# EAGLE design SMAC-2530 (EAGLE 7.1.0)
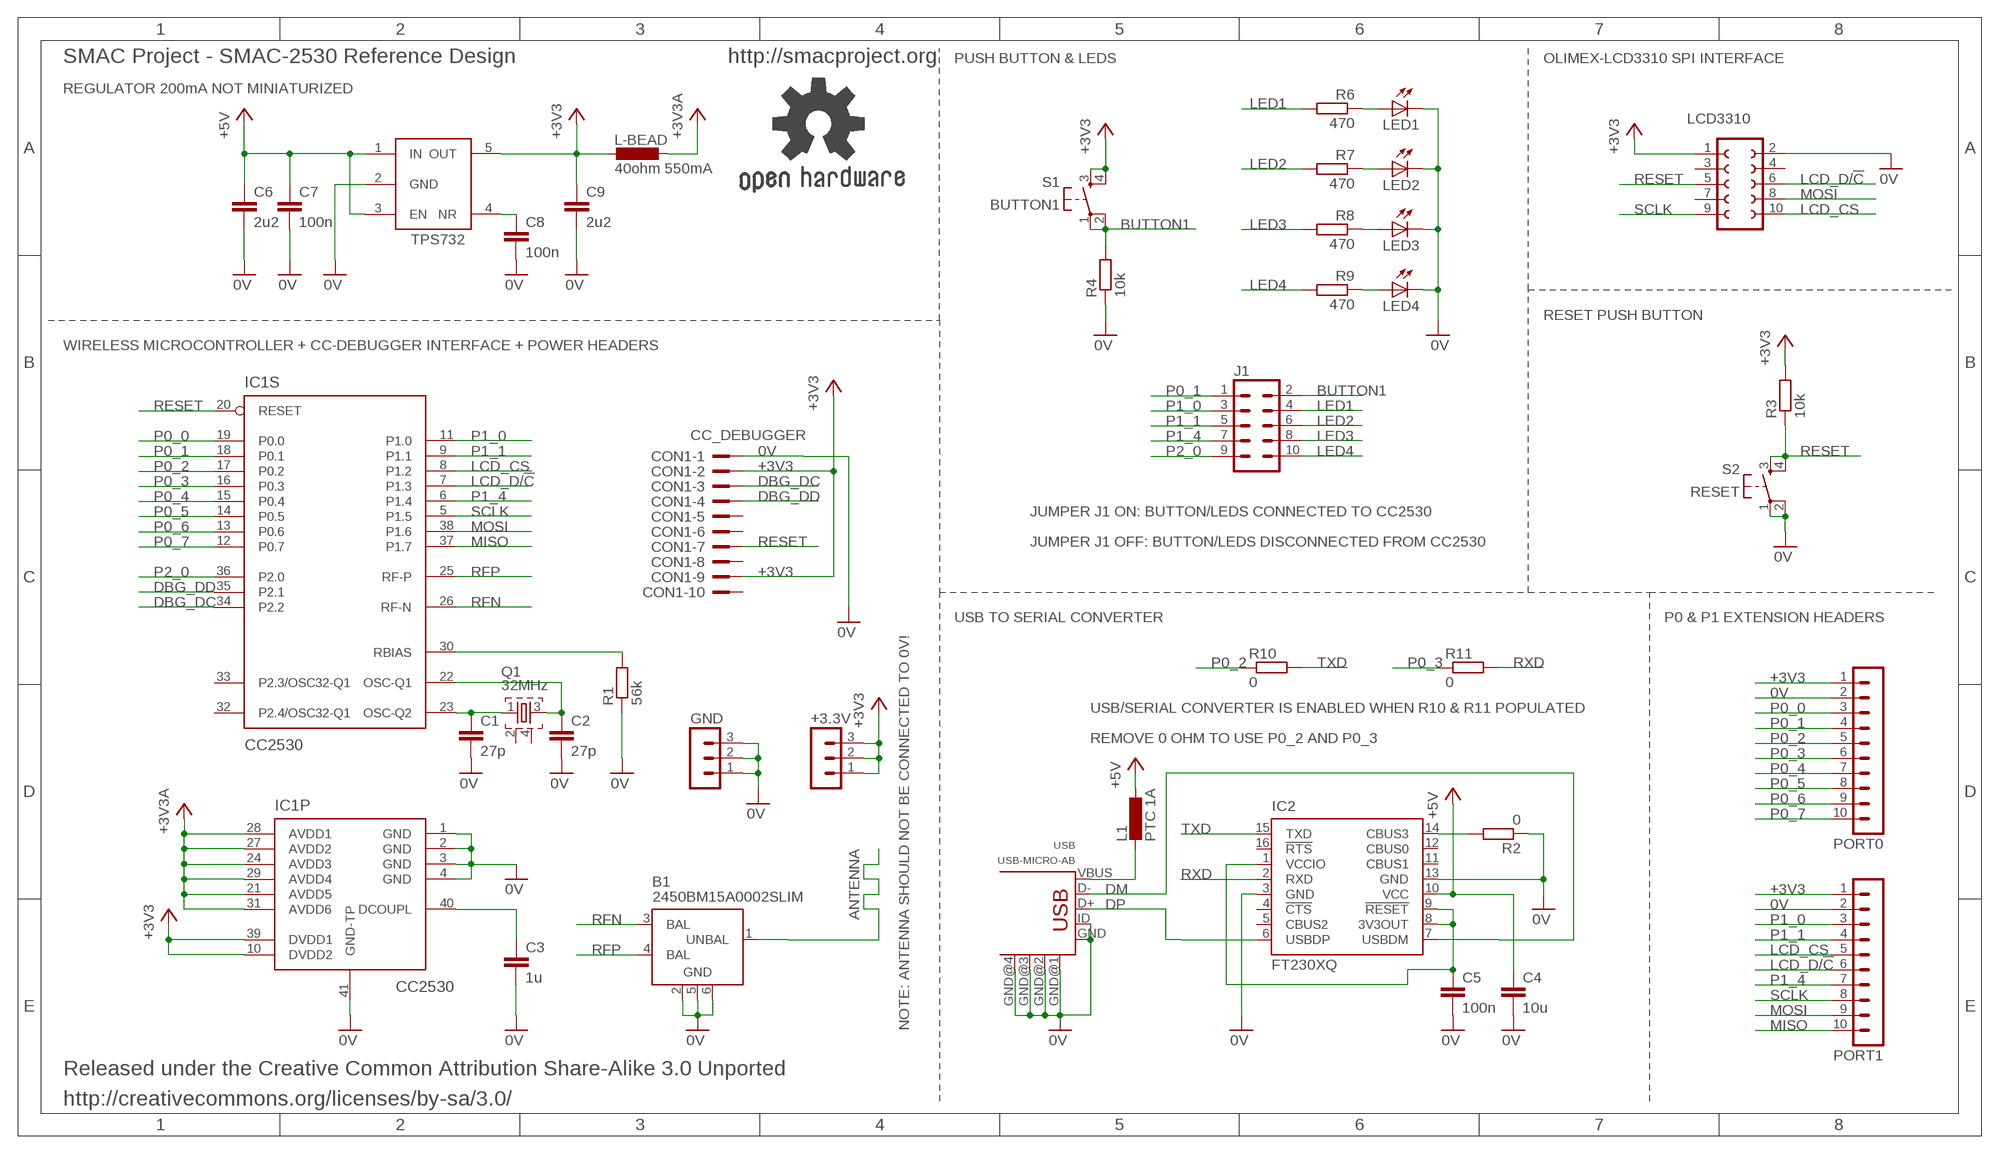
[diagram p0: schematic, sheet 1]

## Parts
+3.3V  MA03-1  [MA03-1]
B1  2450BM15A0002SLIM  [2450BM15A0002-SLIM]
C1  27p  C-EUC0603K  [C0603K]
C2  27p  C-EUC0603K  [C0603K]
C3  1u  C-EUC0603K  [C0603K]
C4  10u  C-EUC0603K  [C0603K]
C5  100n  C-EUC0603K  [C0603K]
C6  2u2  C-EUC0603K  [C0603K]
C7  100n  C-EUC0603K  [C0603K]
C8  100n  C-EUC0603K  [C0603K]
C9  2u2  C-EUC0603K  [C0603K]
CON1  CC_DEBUGGER  2510-  [PAK100/2500-10]
GND  MA03-1  [MA03-1]
GOLD_ORB_SM1  OSHWLOGO_GOLD_ORB_SM  [OSHW2]
IC1  CC2530  [QFN50P600X600X100-41N]
IC2  FT230XQ  [QFN16]
IC3  TPS732XX  [SOT23]
J1  MA05-2  [MA05-2]
L1  PTC 1A  L-EUL0603K  [L0603K]
L-BEAD  40ohm 550mA  L-EUL0603K  [L0603K]
LCD3310  FE05-2  [FE05-2]
LED1  LEDCHIP-LED0805  [CHIP-LED0805]
LED2  LEDCHIP-LED0805  [CHIP-LED0805]
LED3  LEDCHIP-LED0805  [CHIP-LED0805]
LED4  LEDCHIP-LED0805  [CHIP-LED0805]
PORT0  MA10-1  [MA10-1]
PORT1  MA10-1  [MA10-1]
Q1  32MHz  FA-128  [FA-128]
R1  56k  R-EU_R0603K  [R0603K]
R2  0  R-EU_R0603K  [R0603K]
R3  10k  R-EU_R0603K  [R0603K]
R4  10k  R-EU_R0603K  [R0603K]
R6  470  R-EU_R0603K  [R0603K]
R7  470  R-EU_R0603K  [R0603K]
R8  470  R-EU_R0603K  [R0603K]
R9  470  R-EU_R0603K  [R0603K]
R10  0  R-EU_R0603K  [R0603K]
R11  0  R-EU_R0603K  [R0603K]
S1  BUTTON1  ALCOSWITCH-SMD  [ALCOSWITCH-SMD]
S2  RESET  ALCOSWITCH-SMD  [ALCOSWITCH-SMD]
USB  USB-MICRO-AB  USB-OTG_SHIELD  [USB-UAB-S1]

## Nets
0V: B1.1(UNBAL) B1.2(GND) B1.5(GND) B1.6(GND) C1.2 C2.2 C3.2 C4.2 C5.2 C6.2 C7.2 C8.2 C9.2 CON1.1 GND.1 GND.2 GND.3 IC1.1(GND) IC1.2(GND) IC1.3(GND) IC1.4(GND) IC1.41(GND-TP) IC2.3(GND) IC2.13(GND) IC3.2(GND) LCD3310.2 LED1.C LED2.C LED3.C LED4.C PORT0.2 PORT1.2 R1.1 R2.1 R4.1 S2.1(P) S2.2(P1) USB.GND USB.GND@1(GND) USB.GND@2(GND) USB.GND@3(GND) USB.GND@4(GND) USB.ID
+3V3: +3.3V.1 +3.3V.2 +3.3V.3 C9.1 CON1.2 CON1.9 IC1.10(DVDD2) IC1.39(DVDD1) IC3.5(OUT) L-BEAD.1 LCD3310.1 PORT0.1 PORT1.1 R3.2 S1.3(S) S1.4(S1)
+3V3A: IC1.21(AVDD5) IC1.24(AVDD3) IC1.27(AVDD2) IC1.28(AVDD1) IC1.29(AVDD4) IC1.31(AVDD6) L-BEAD.2
+5V: C4.1 C6.1 C7.1 IC2.10(VCC) IC3.1(IN) IC3.3(EN) L1.1
BUTTON1: J1.2 R4.2 S1.1(P) S1.2(P1)
DBG_DC: CON1.3 IC1.34(P2.2)
DBG_DD: CON1.4 IC1.35(P2.1)
DM: IC2.7(USBDM) USB.D-
DP: IC2.6(USBDP) USB.D+
LCD_CS: IC1.8(P1.2) LCD3310.10 PORT1.5
LCD_D/!C: IC1.7(P1.3) LCD3310.6 PORT1.6
LED1: J1.4 R6.2
LED2: J1.6 R7.2
LED3: J1.8 R8.2
LED4: J1.10 R9.2
MISO: IC1.37(P1.7) PORT1.10
MOSI: IC1.38(P1.6) LCD3310.8 PORT1.9
N$1: C3.1 IC1.40(DCOUPL)
N$2: L1.2 USB.VBUS
N$3: C2.1 IC1.22(OSC-Q1) Q1.3
N$4: C1.1 IC1.23(OSC-Q2) Q1.1
N$5: IC1.30(RBIAS) R1.2
N$7: IC2.14(CBUS3) R2.2
N$8: C8.1 IC3.4(NR)
N$9: LED1.A R6.1
N$10: LED2.A R7.1
N$11: LED3.A R8.1
N$12: LED4.A R9.1
P0_0: IC1.19(P0.0) PORT0.3
P0_1: IC1.18(P0.1) J1.1 PORT0.4
P0_2: IC1.17(P0.2) PORT0.5 R10.1
P0_3: IC1.16(P0.3) PORT0.6 R11.1
P0_4: IC1.15(P0.4) PORT0.7
P0_5: IC1.14(P0.5) PORT0.8
P0_6: IC1.13(P0.6) PORT0.9
P0_7: IC1.12(P0.7) PORT0.10
P1_0: IC1.11(P1.0) J1.3 PORT1.3
P1_1: IC1.9(P1.1) J1.5 PORT1.4
P1_4: IC1.6(P1.4) J1.7 PORT1.7
P2_0: IC1.36(P2.0) J1.9
RESET: CON1.7 IC1.20(RESET) LCD3310.5 R3.1 S2.3(S) S2.4(S1)
RFN: B1.3(BAL) IC1.26(RF-N)
RFP: B1.4(BAL) IC1.25(RF-P)
RXD: IC2.2(RXD) R11.2
SCLK: IC1.5(P1.5) LCD3310.9 PORT1.8
TXD: IC2.15(TXD) R10.2
VIO: C5.1 IC2.1(VCCIO) IC2.8(3V3OUT) IC2.9(!RESET)
Unconnected: CON1.5 CON1.6 CON1.8 CON1.10 IC1.32(P2.4/OSC32-Q1) IC1.33(P2.3/OSC32-Q1) IC2.4(!CTS) IC2.5(CBUS2) IC2.11(CBUS1) IC2.12(CBUS0) IC2.16(!RTS) LCD3310.3 LCD3310.4 LCD3310.7 Q1.2 Q1.4

## Notes on the sheet
- SMAC Project - SMAC-2530 Reference Design | http://smacproject.org | PUSH BUTTON & LEDS | OLIMEX-LCD3310 SPI INTERFACE
- REGULATOR 200mA NOT MINIATURIZED
- RESET PUSH BUTTON
- WIRELESS MICROCONTROLLER + CC-DEBUGGER INTERFACE + POWER HEADERS
- JUMPER J1 ON: BUTTON/LEDS CONNECTED TO CC2530
- JUMPER J1 OFF: BUTTON/LEDS DISCONNECTED FROM CC2530
- USB TO SERIAL CONVERTER | P0 & P1 EXTENSION HEADERS
- USB/SERIAL CONVERTER IS ENABLED WHEN R10 & R11 POPULATED
- REMOVE 0 OHM TO USE P0_2 AND P0_3
- ANTENNA
- NOTE: ANTENNA SHOULD NOT BE CONNECTED TO 0V!
- Released under the Creative Common Attribution Share-Alike 3.0 Unported
- http://creativecommons.org/licenses/by-sa/3.0/

## Library data of the parts
+3.3V GND = con-lstb:MA03-1: PIN HEADER
B1 = johanson-technology:2450BM15A0002: 2.45 GHz Impedance Matched Balun-Filter For TI CC253X/CC2540 Chipset family Data sheet <http://www.johansontechnology.com/images/stories/ip/baluns/balun_filter_combo_matched_2450bm15a0002_v8.pdf>
C1-C9 = resistor:C-EU: CAPACITOR, European symbol
CON1 = con-3m:2510-: 3M (TM) Pak 100 4-Wall Header Source: 3M; MF: 3M; MPN: 2510-6002UB; OC_FARNELL: 9838244; OC_NEWARK: 46F4725
GOLD_ORB_SM1 = bfl:OSHWLOGO: These are Open-Source Hardware logos.
IC1 = chipcon-ti-v2:CC2530: A True System-on-Chip Solution for 2.4-GHz IEEE 802.15.4 and ZigBee Applications
IC2 = ftdichip:FT230X: USB to BASIC UART IC Auto generated by make-symbol-device-package-bsdl.ulp Rev. 43 Source: Data sheet <http://www.ftdichip.com/Support/Documents/DataSheets/ICs/DS_FT230X.pdf>
IC3 = TPS732xx:TPS732XX
J1 = con-lstb:MA05-2: PIN HEADER
L1 L-BEAD = resistor:L-EU: INDUCTOR, European symbol
LCD3310 = con-lsta:FE05-2: FEMALE HEADER; OC_FARNELL: unknown; OC_NEWARK: unknown
LED1-LED4 = led:LED: LED OSRAM: - CHIPLED LG R971, LG N971, LY N971, LG Q971, LY Q971, LO R971, LY R971 LH N974, LH R974 LS Q976, LO Q976, LY Q976 LO Q996 - Hyper CHIPLED LW Q18S LB Q993, LB Q99A, LB R99A - SideLED LS A670, LO A670, LY A670, LG A670, LP A670 LB A673, LV A673, LT A673, LW A673 LH A674 LY A675 LS A676, LA A676, LO A676, LY A676, LW A676 LS A679, LY A679, LG A679 - Hyper Micro SIDELED® LS Y876, LA Y876, LO Y876, LY Y876 LT Y87S - SmartLED LW L88C, LW L88S LB L89C, LB L89S, LG L890 LS L89K, LO L89K, LY L89K LS L896, LA L896, LO L896, LY L896 - TOPLED LS T670, LO T670, LY T670, LG T670, LP T670 LSG T670, LSP T670, LSY T670, LOP T670, LYG T670 LG T671, LOG T671, LSG T671 LB T673, LV T673, LT T673, LW T673 LH T674 LS T676, LA T676, LO T676, LY T676, LB T676, LH T676, LSB T676, LW T676 LB T67C, LV T67C, LT T67C, LS T67K, LO T67K, LY T67K, LW E67C LS E67B, LA E67B, LO E67B, LY E67B, LB E67C, LV E67C, LT E67C LW T67C LS T679, LY T679, LG T679 LS T770, LO T770, LY T770, LG T770, LP T770 LB T773, LV T773, LT T773, LW T773 LH T774 LS E675, LA E675, LY E675, LS T675 LS T776, LA T776, LO T776, LY T776, LB T776 LHGB T686 LT T68C, LB T68C - Hyper Mini TOPLED® LB M676 - Mini TOPLED Santana® LG M470 LS M47K, LO M47K, LY M47K Source: http://www.osram.convergy.de LUXEON: - LUMILED® LXK2-PW12-R00, LXK2-PW12-S00, LXK2-PW14-U00, LXK2-PW14-V00 LXK2-PM12-R00, LXK2-PM12-S00, LXK2-PM14-U00 LXK2-PE12-Q00, LXK2-PE12-R00, LXK2-PE12-S00, LXK2-PE14-T00, LXK2-PE14-U00 LXK2-PB12-K00, LXK2-PB12-L00, LXK2-PB12-M00, LXK2-PB14-N00, LXK2-PB14-P00, LXK2-PB14-Q00 LXK2-PR12-L00, LXK2-PR12-M00, LXK2-PR14-Q00, LXK2-PR14-R00 LXK2-PD12-Q00, LXK2-PD12-R00, LXK2-PD12-S00 LXK2-PH12-R00, LXK2-PH12-S00 LXK2-PL12-P00, LXK2-PL12-Q00, LXK2-PL12-R00 Source: www.luxeon.com KINGBRIGHT: KA-3528ASYC Source: www.kingbright.com
PORT0 PORT1 = con-lstb:MA10-1: PIN HEADER
Q1 = crystal:FA-: MHz RANGE CRYSTAL UNIT Source: Epson Toyocom
R1-R4 R6-R11 = resistor:R-EU_: RESISTOR, European symbol
S1 S2 = switch-alco:ALCOSWITCH-SMD
USB = con-usb-2:USB-OTG_SHIELD

## Board
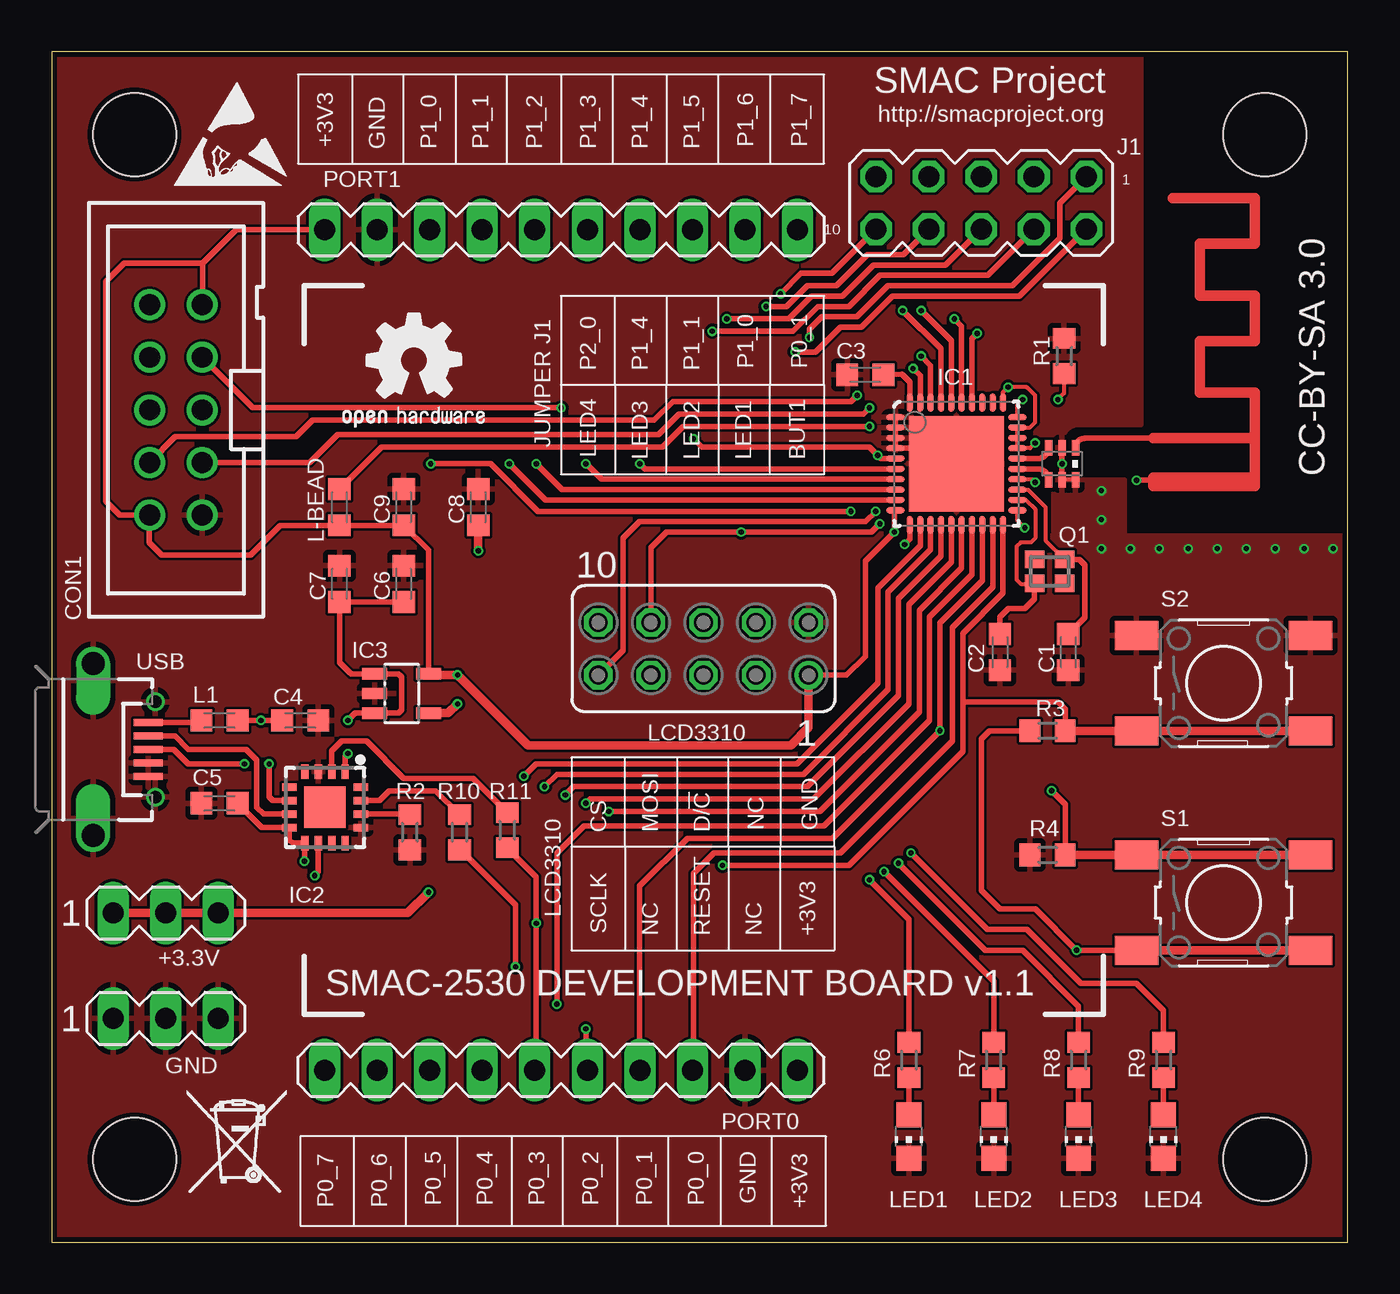
[diagram p1: board, top side]
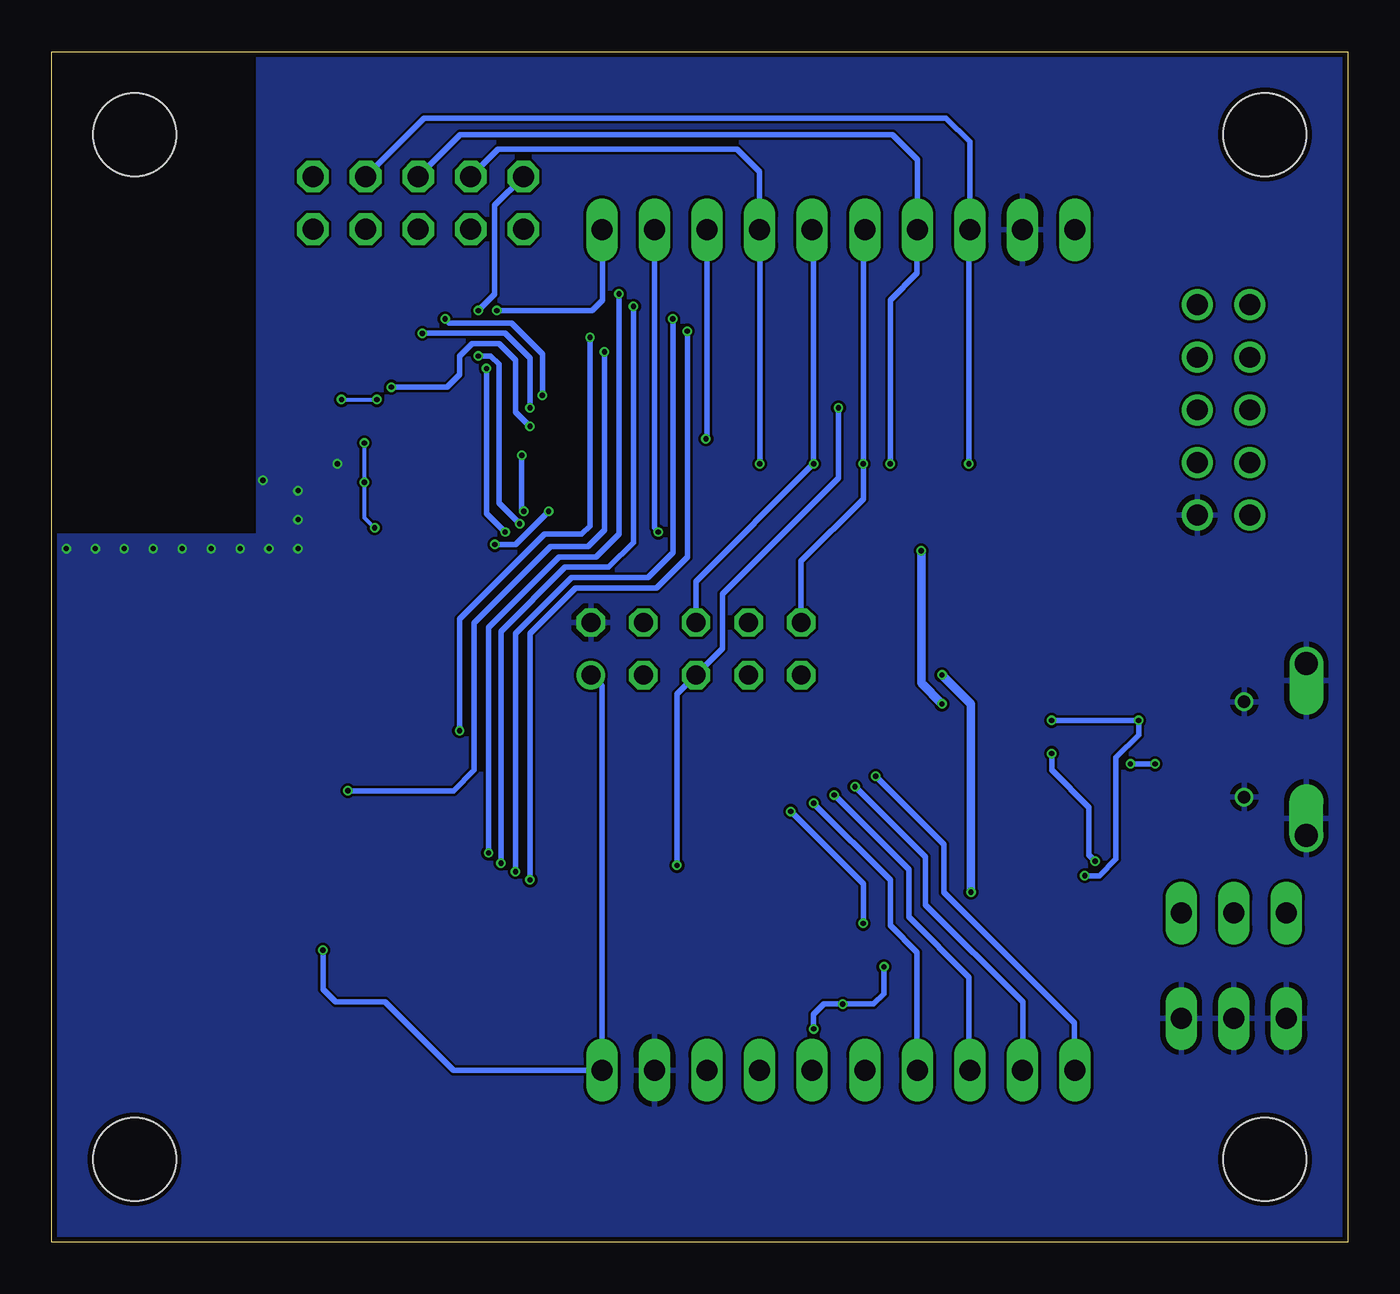
[diagram p2: board, bottom side, seen from below]

Size 62.6 x 57.5 mm. Coordinates in mm from the lower left corner, seen from the top.
Outline: 0,0 62.6,0 62.6,57.5 0,57.5 0,0
Copper layers (1+2*15+16): Top 0.0356mm / dielectric 0.1702mm / layer 2 0.0178mm / dielectric 47mil / layer 15 0.0178mm / dielectric 0.1702mm / Bottom 0.0356mm
Design rules "LaenPCBOrder - 4 layers": minimum track width 5mil, minimum drill 10mil, track to track 5mil, track to pad 5mil, pad to pad 5mil, via to via 5mil, smd to smd 5mil, copper to edge 10mil, drill to drill 5mil, minimum pad ring 4mil, minimum via ring 4mil, stop-mask expansion 3mil, vias tented up to drill 4.5mil, thermal gap 10mil
Holes 4 mm at 4,53.5 58.6,53.5 58.6,4 4,4

### Footprints (pad centres in the part's own frame; a part is rotated, then mirrored left to right if it is on the bottom)
MA03-1 = drill 1.016 long: 1 -2.54,0; 2 0,0; 3 2.54,0
2450BM15A0002-SLIM = smd 0.35 x 0.75: 1 -0.65,-0.775; 2 0,-0.775; 3 0.65,-0.775; 4 0.65,0.775; 5 0,0.775; 6 -0.65,0.775
C0603K = smd 1.05 x 1.08: 1 -0.875,0; 2 0.875,0
PAK100/2500-10 = drill 1 pad 1.422: 1 -5.08,-1.27; 2 -5.08,1.27; 3 -2.54,-1.27; 4 -2.54,1.27; 5 0,-1.27; 6 0,1.27; 7 2.54,-1.27; 8 2.54,1.27; 9 5.08,-1.27; 10 5.08,1.27
QFN50P600X600X100-41N = smd 0.9 x 0.3: 1 -2.95,2.25; 2 -2.95,1.75; 3 -2.95,1.25; 4 -2.95,0.75; 5 -2.95,0.25; 6 -2.95,-0.25; 7 -2.95,-0.75; 8 -2.95,-1.25; 9 -2.95,-1.75; 10 -2.95,-2.25; 21 2.95,-2.25; 22 2.95,-1.75; 23 2.95,-1.25; 24 2.95,-0.75; 25 2.95,-0.25; 26 2.95,0.25; 27 2.95,0.75; 28 2.95,1.25; 29 2.95,1.75; 30 2.95,2.25 | smd 0.3 x 0.9: 11 -2.25,-2.95; 12 -1.75,-2.95; 13 -1.25,-2.95; 14 -0.75,-2.95; 15 -0.25,-2.95; 16 0.25,-2.95; 17 0.75,-2.95; 18 1.25,-2.95; 19 1.75,-2.95; 20 2.25,-2.95; 31 2.25,2.95; 32 1.75,2.95; 33 1.25,2.95; 34 0.75,2.95; 35 0.25,2.95; 36 -0.25,2.95; 37 -0.75,2.95; 38 -1.25,2.95; 39 -1.75,2.95; 40 -2.25,2.95 | smd 4.6 x 4.6: 41 0,0
QFN16 = smd 0.7 x 0.35: 1 -1.725,0.975; 2 -1.725,0.325; 3 -1.725,-0.325; 4 -1.725,-0.975; 9 1.725,-0.975; 10 1.725,-0.325; 11 1.725,0.325; 12 1.725,0.975 | smd 0.35 x 0.7: 5 -0.975,-1.725; 6 -0.325,-1.725; 7 0.325,-1.725; 8 0.975,-1.725; 13 0.975,1.725; 14 0.325,1.725; 15 -0.325,1.725; 16 -0.975,1.725 | smd 2 x 2: TAB 0,0
SOT23 = smd 0.55 x 1.2: 1 -0.95,-1.3; 2 0,-1.3; 3 0.95,-1.3; 4 0.95,1.3; 5 -0.95,1.3
MA05-2 = drill 1.016 octagon: 1 -5.08,-1.27; 2 -5.08,1.27; 3 -2.54,-1.27; 4 -2.54,1.27; 5 0,-1.27; 6 0,1.27; 7 2.54,-1.27; 8 2.54,1.27; 9 5.08,-1.27; 10 5.08,1.27
L0603K = smd 1.05 x 1.08: 1 -0.875,0; 2 0.875,0
FE05-2 = drill 0.914: 1 -5.08,1.27 | drill 0.914 octagon: 2 -5.08,-1.27; 3 -2.54,1.27; 4 -2.54,-1.27; 5 0,1.27; 6 0,-1.27; 7 2.54,1.27; 8 2.54,-1.27; 9 5.08,1.27; 10 5.08,-1.27
CHIP-LED0805 = smd 1.2 x 1.2: A 0,-1.05; C 0,1.05
MA10-1 = drill 1.016 long: 1 -11.43,0; 2 -8.89,0; 3 -6.35,0; 4 -3.81,0; 5 -1.27,0; 6 1.27,0; 7 3.81,0; 8 6.35,0; 9 8.89,0; 10 11.43,0
FA-128 = smd 0.95 x 0.85: 1 -0.725,-0.575; 2 0.725,-0.575; 3 0.725,0.575; 4 -0.725,0.575
R0603K = smd 1 x 1.1: 1 -0.85,0; 2 0.85,0
ALCOSWITCH-SMD = smd 2.1 x 1.4: 1 -4.2,2.3; 2 4.2,2.3; 3 -4.2,-2.3; 4 4.2,-2.3
USB-UAB-S1 = smd 0.35 x 1.4: D+ 0,2.65; D- -0.65,2.65; GND 1.3,2.65; ID 0.65,2.65; VBUS -1.3,2.65 | drill 0.6: GND@1 -2.3,3; GND@2 2.3,3 | drill 1.1 offset: GND@3 -4.15,0; GND@4 4.15,0

### Placement (x,y rotation side)
+3.3V  5.5,15.9 0 top
B1  48.8,37.6 180 top
C1  49.1,28.5 270 top
C2  45.8,28.5 270 top
C3  39.3,41.9 180 top
C4  12,25.2 0 top
C5  8.1,21.2 180 top
C6  17,31.8 90 top
C7  13.9,31.8 90 top
C8  20.6,35.5 90 top
C9  17,35.5 90 top
CON1  6,40.2 90 top
GND  5.5,10.8 0 top
GOLD_ORB_SM1  13.9,39.2 0 top
IC1  43.7,37.6 0 top
IC2  13.2,21 270 top
IC3  16.9,26.5 270 top
J1  44.9,50.2 180 top
L1  8.1,25.2 180 top
L-BEAD  13.9,35.5 90 top
LCD3310  31.48,28.66 180 top
LED1  41.4,5.1 180 top
LED2  45.5,5.1 180 top
LED3  49.6,5.1 180 top
LED4  53.7,5.1 180 top
PORT0  24.6,8.3 180 top
PORT1  24.6,48.9 0 top
Q1  48.2,32.4 180 top
R1  48.9,42.8 270 top
R2  17.3,19.8 90 top
R3  48.1,24.7 180 top
R4  48.1,18.7 0 top
R6  41.4,8.8 90 top
R7  45.5,8.8 90 top
R8  49.6,8.8 90 top
R9  53.7,8.8 90 top
R10  19.7,19.8 90 top
R11  22,19.9 90 top
S1  56.6,16.4 0 top
S2  56.6,27 0 top
USB  2,23.8 270 top

### Tracks (layer width: path | path; a pad name or v marks a point on that pad's centre or on a via)
0V  (via drill 0.25)
  Top 0.203: 53.21,36.53 53.21,36.58 | 53.21,36.73 53.14,36.8 | B1.6 B1.5
  Top 0.254: 53.14,36.8 v52.4,36.8 | B1.2 v48.8,37.6 B1.5 | IC1.41 42.95,38.35 IC1.4 IC1.3 IC1.2 IC1.1 | B1.1 arc-90 49.9,38.83 53.21,38.83
  Top 0.5: 54.16,50.43 58.11,50.43 58.11,48.23 55.46,48.23 55.46,45.73 58.11,45.73 58.11,43.53 55.46,43.53 55.46,41.03 58.11,41.03 58.11,38.83 | 53.21,38.83 58.11,38.83 | 58.11,38.83 58.11,36.93 | 58.11,36.93 58.11,36.53 53.21,36.53 53.21,36.58 53.21,36.73 53.21,36.93 58.11,36.93
  other vias: 50.7,36.3 52.1,33.5 50.7,34.9 50.7,33.5 53.5,33.5 54.9,33.5 56.3,33.5 57.7,33.5 59.1,33.5 60.5,33.5 61.9,33.5
  pour Bottom: 0,57.5 52.6,57.5 52.6,34.1 62.59,34.12 62.6,0 0,0
  pour Top: 0,57.5 52.6,57.5 52.6,39.5 49.6,39.5 arc90 48.8,38.7 48.8,38.3 47.5,38.3 47.5,39.5 45.9,39.5 45.9,34.1 48.4,34.1 48.4,36.8 51.8,36.8 51.8,34.1 62.6,34.1 62.6,0 0,0
+3V3  (via drill 0.25)
  Top 0.254: IC3.5 18.2,33.42 C9.1 L-BEAD.1 11.03,34.62 9.6,33.2 5.3,33.2 4.7,33.8 4.7,35.09 CON1.2 3.28,35.12 2.6,35.8 2.6,46.4 3.5,47.3 7.3,47.3 | PORT1.1 8.9,48.9 7.3,47.3 | 7.3,47.3 7.3,45.31 CON1.9 | IC1.39 41.95,41.85 v41.6,42.2 | LCD3310.1 38.39,27.39 39.3,28.3 39.3,32.9 v40.7,34.3 40.7,35.3 IC1.10 | R3.2 45.3,24.7 44.9,24.3 44.9,17 45.8,16.1 47.5,16.1 v49.5,14.1 S1.3
  Top 0.406: +3.3V.1 +3.3V.2 +3.3V.3 17.2,15.9 v18.2,16.9 | IC3.5 18.25,27.4 v19.6,27.4 23,24 35.7,24 36.56,24.86 LCD3310.1 | S1.4 S1.3
  Bottom 0.254: v41.6,42.2 41.6,35.2 v40.7,34.3 | LCD3310.1 36.03,26.86 PORT0.1 43.2,8.3 46.5,11.6 48.9,11.6 49.5,12.2 v49.5,14.1
  Bottom 0.406: v18.2,16.9 18.2,26 v19.6,27.4
+3V3A  (via drill 0.25)
  Top 0.203: IC1.31 45.95,41.05 46,41.1 v46.2,41.3 47.1,41.3 47.5,40.9 47.5,39.6 47.25,39.35 IC1.29 IC1.28 IC1.27 47.25,38.35 v47.5,38.6 | v47,34.5 46.65,34.85 IC1.21 | IC1.24 47.35,36.85 v47.5,36.7
  Top 0.254: L-BEAD.2 15.93,38.4 29.5,38.4 30.5,39.4 38.8,39.4 v39.5,39.4
  Bottom 0.203: v47,34.5 47.5,35 v47.5,36.7 v47.5,38.6
  Bottom 0.254: v39.5,39.4 40.2,40.1 40.2,42.6 41,43.4 42.3,43.4 42.9,42.8 42.9,41.9 43.5,41.3 v46.2,41.3
+5V  (via drill 0.25)
  Top 0.203: 16.75,27.45 16.8,27.4 | 14.45,27.45 14.4,27.5
  Top 0.254: L1.1 v10.1,25.2 C4.1 | IC2.10 12.88,17.88 v12.7,17.7 | v14.3,25.2 14.65,25.55 IC3.3 16.75,25.55 16.9,25.7 16.9,27.3 16.8,27.4 | 16.75,27.45 IC3.1 14.45,27.45 | C6.1 C7.1 13.9,29.1 13.9,28 14.4,27.5
  Bottom 0.254: v12.7,17.7 12,17.7 11.2,18.5 11.2,23.4 10.1,24.5 v10.1,25.2 v14.3,25.2
BUTTON1  (via drill 0.25)
  Top 0.254: R4.2 48.95,21.15 v48.3,21.8 | J1.2 46.75,45.7 40.6,45.7 39.1,44.2 38.1,44.2 36.9,43 v35.9,43
  Top 0.406: S1.2 S1.1 R4.2
  Bottom 0.254: v48.3,21.8 43.2,21.8 42.2,22.8 42.2,29.9 38.5,33.6 36.7,33.6 35.9,34.4 35.9,41.3 v35.9,43
DBG_DC  (via drill 0.25)
  Top 0.254: CON1.3 12.46,37.66 13.2,38.4 13.8,39 29.3,39 30.3,40 38.6,40 39.2,40 v39.5,40.3 | v44.7,43.9 44.45,43.65 IC1.34
  Bottom 0.254: v39.5,40.3 39.5,42.7 40.7,43.9 v44.7,43.9
DBG_DD  (via drill 0.25)
  Top 0.254: CON1.4 5.97,38.9 11.8,38.9 12.2,39.3 12.6,39.7 29.1,39.7 30,40.6 38.6,40.6 v38.9,40.9 | v43.6,44.6 43.95,44.25 IC1.35
  Bottom 0.254: v38.9,40.9 38.9,42.9 40.4,44.4 43.4,44.4 v43.6,44.6
DM
  Top 0.254: IC2.7 10.23,20.67 9.9,21 9.9,23.3 9.4,23.8 6.6,23.8 5.95,24.45 USB.D-
DP  (via drill 0.25)
  Top 0.254: IC2.6 10.68,21.32 10.5,21.5 v10.5,23.1 | v9.3,23.1 6.6,23.1 5.9,23.8 USB.D+
  Bottom 0.254: v10.5,23.1 v9.3,23.1
LCD_CS  (via drill 0.25)
  Top 0.254: IC1.8 24.65,36.35 v23.4,37.6
  Bottom 0.254: PORT1.5 23.4,48.83 v23.4,37.6 23.4,35.9 26.4,32.9 LCD3310.10
LCD_D/!C  (via drill 0.25)
  Top 0.254: IC1.7 26.55,36.85 v25.8,37.6
  Bottom 0.254: PORT1.6 25.8,48.83 v25.8,37.6 31.48,31.92 LCD3310.6
LED1  (via drill 0.25)
  Top 0.254: R6.2 41.4,15.6 v39.5,17.5 | J1.4 45.21,46.7 40,46.7 38.5,45.2 37,45.2 35.8,44 v31.9,44
  Bottom 0.254: v39.5,17.5 39.5,29.4 37.3,31.6 33.4,31.6 31.9,33.1 31.9,40.8 v31.9,44
LED2  (via drill 0.25)
  Top 0.254: R7.2 45.5,12.6 v40.2,17.9 | J1.6 43.17,47.2 39.7,47.2 38.2,45.7 36.7,45.7 35.6,44.6 v32.6,44.6
  Bottom 0.254: v40.2,17.9 40.2,29.4 37.5,32.1 33.8,32.1 32.6,33.3 32.6,42.2 v32.6,44.6
LED3  (via drill 0.25)
  Top 0.254: R8.2 49.6,11.4 46.9,14.1 45.1,14.1 v40.9,18.3 | v34.5,45.2 35.5,45.2 36.5,46.2 37.9,46.2 39.4,47.7 41.13,47.7 J1.8
  Bottom 0.254: v40.9,18.3 40.9,29.5 37.8,32.6 35.7,32.6 34.5,33.8 34.5,41 v34.5,45.2
LED4  (via drill 0.25)
  Top 0.254: R9.2 53.7,11.2 52.4,12.5 49.7,12.5 47.1,15.1 45.2,15.1 v41.5,18.8 | J1.10 37.69,46.8 36.2,46.8 v35.2,45.8
  Bottom 0.254: v41.5,18.8 41.5,29.7 38.1,33.1 36.3,33.1 35.2,34.2 35.2,41.8 v35.2,45.8
MISO  (via drill 0.25)
  Top 0.254: IC1.37 42.95,43.15 v41.1,45
  Bottom 0.254: v41.1,45 36.5,45 36,45.5 36,48.87 PORT1.10
MOSI  (via drill 0.25)
  Top 0.254: LCD3310.8 28.94,33.54 29.7,34.3 v33.3,34.3 39.6,34.3 v40,34.7 | v42,42.8 42.45,42.35 IC1.38
  Bottom 0.254: v42,42.8 41.4,42.8 41,42.4 41,35.7 v40,34.7 | PORT1.9 33.49,34.51 v33.3,34.3
N$1
  Top 0.203: 41.08,41.92 41.1,41.9
  Top 0.254: IC1.40 41.45,41.55 41.1,41.9 | C3.1 41.08,41.92
N$2
  Top 0.254: USB.VBUS 7.12,25.1 L1.2
N$3
  Top 0.203: IC1.22 47.05,35.85 47.5,35.4 47.5,34 47.3,33.8 46.8,33.8 46.6,33.6 46.6,32 46.8,31.8 47.45,31.8 Q1.3
  Top 0.254: Q1.3 47.47,31.07 47,30.6 46.2,30.6 45.8,30.2 C2.1
N$4
  Top 0.203: IC1.23 47.15,36.35 47.9,35.6 48,35.5 48,33.9 Q1.1
  Top 0.254: C1.1 49.9,30.17 49.9,32.7 49.62,32.98 Q1.1
N$5  (via drill 0.25)
  Top 0.203: IC1.30 46.65,40.45 v46.9,40.7 | R1.2 48.9,41 v48.6,40.7
  Bottom 0.203: v48.6,40.7 v46.9,40.7
N$7
  Top 0.203: 17.28,20.67 R2.2
  Top 0.254: IC2.14 17.28,20.67
N$8  (via drill 0.25)
  Top 0.406: IC3.4 19.15,25.55 v19.6,26 | v20.6,33.4 C8.1
  Bottom 0.406: v19.6,26 20.6,27 v20.6,33.4
N$9
  Top 0.254: LED1.A R6.1
N$10
  Top 0.254: LED2.A R7.1
N$11
  Top 0.254: LED3.A R8.1
N$12
  Top 0.254: LED4.A R9.1
P0_0
  Top 0.254: IC1.19 45.45,31.65 43.5,29.7 43.5,24.2 43.4,24.1 38.1,18.8 32,18.8 31,17.8 31,8.35 PORT0.3
P0_1  (via drill 0.25)
  Top 0.254: IC1.18 44.95,31.95 42.9,29.9 v42.9,24.7 37.7,19.5 30.7,19.5 28.4,17.2 PORT0.4 | J1.1 48.7,50.19 48.7,48.5 46.4,46.2 40.4,46.2 38.9,44.7 37.2,44.7 36.6,44.1 v36.6,43.7
  Bottom 0.254: v42.9,24.7 42.9,30.1 38.8,34.2 37,34.2 36.6,34.6 36.6,41.3 v36.6,43.7
P0_2  (via drill 0.25)
  Top 0.254: v25.8,10.3 25.8,8.37 PORT0.5 | IC1.17 44.45,32.25 42.4,30.2 42.4,25.2 37.3,20.1 25.7,20.1 24.4,18.8 v24.4,11.5 | v22.4,13.3 22.4,16.3 20.4,18.3 19.75,18.95 R10.1
  Bottom 0.254: v22.4,13.3 22.4,12 22.9,11.5 v24.4,11.5 25.3,11.5 25.8,11 v25.8,10.3
P0_3  (via drill 0.25)
  Top 0.254: PORT0.6 23.4,8.37 v23.4,15.4 23.4,17.65 R11.1 | IC1.16 43.95,32.55 41.9,30.5 41.9,25.6 37.1,20.8 v26.9,20.8
  Bottom 0.254: v26.9,20.8 23.4,17.3 v23.4,15.4
P0_4  (via drill 0.25)
  Top 0.254: IC1.15 43.45,32.85 41.4,30.8 41.4,26 36.8,21.4 26,21.4 v25.8,21.2
  Bottom 0.254: PORT0.7 20.8,14 22.1,15.3 22.1,17.5 v25.8,21.2
P0_5  (via drill 0.25)
  Top 0.254: IC1.14 42.95,33.15 40.9,31.1 40.9,26.4 36.5,22 25.2,22 v24.8,21.6
  Bottom 0.254: PORT0.8 18.3,8.35 18.3,12.8 21.2,15.7 21.2,18 v24.8,21.6
P0_6  (via drill 0.25)
  Top 0.254: IC1.13 42.45,33.45 40.4,31.4 40.4,26.7 36.3,22.6 24.4,22.6 v23.8,22
  Bottom 0.254: PORT0.9 15.7,11.6 20.4,16.3 20.4,18.6 v23.8,22
P0_7  (via drill 0.25)
  Top 0.254: IC1.12 41.95,33.65 39.9,31.6 39.9,27 36,23.1 23.4,23.1 v22.8,22.5
  Bottom 0.254: PORT0.10 13.2,8.33 13.2,10.6 19.5,16.9 19.5,19.2 v22.8,22.5
P1_0  (via drill 0.25)
  Top 0.254: IC1.11 41.45,33.95 v41.2,33.7 | v38.6,35.3 23.5,35.3 21.2,37.6 v18.3,37.6
  Bottom 0.254: v41.2,33.7 40.2,33.7 v38.6,35.3 | v18.3,37.6 18.3,48.85 PORT1.3 18.25,53.15 19.4,54.3 44.61,54.3 J1.3
P1_1  (via drill 0.25)
  Top 0.254: IC1.9 23.85,35.85 v22.1,37.6
  Bottom 0.254: v22.1,37.6 22.1,45.5 20.8,46.8 PORT1.4 20.79,52.29 22,53.5 42.87,53.5 J1.5
P1_4  (via drill 0.25)
  Top 0.254: IC1.6 28.65,37.35 v28.4,37.6
  Bottom 0.254: v28.4,37.6 PORT1.7 28.41,51.71 29.5,52.8 41.03,52.8 J1.7
P2_0  (via drill 0.25)
  Top 0.254: IC1.36 43.45,43.55 v42,45
  Bottom 0.254: v42,45 41.2,45.8 41.2,50.09 J1.9
RESET  (via drill 0.25)
  Top 0.254: CON1.7 9.71,40.3 v24.6,40.3 | IC1.20 45.95,31.35 44,29.4 44,26.1 | v32.4,18.2 38.5,18.2 44,23.7 44,26.1 | R3.1 48.95,25.75 48.6,26.1 44,26.1
  Top 0.406: S2.4 S2.3 R3.1
  Bottom 0.254: v32.4,18.2 32.4,26.47 LCD3310.5 30.2,28.67 30.2,31.3 24.6,36.9 v24.6,40.3
RFN
  Top 0.254: IC1.26 47.62,37.85 arc90 B1.3
RFP
  Top 0.254: IC1.25 47.62,37.35 arc-90 B1.4
RXD
  Top 0.254: R11.2 20.35,22.4 17,22.4 15.2,24.2 14,24.2 13.53,23.72 IC2.2
SCLK  (via drill 0.25)
  Top 0.254: LCD3310.9 27.6,28.59 27.6,34 28.4,34.8 39.3,34.8 v39.8,35.3 | IC1.5 40.05,37.85 v39.9,38 39.5,38.4 31.4,38.4 v31,38.8
  Bottom 0.254: v31,38.8 30.95,38.85 PORT1.8 | v39.9,38 39.9,35.4 v39.8,35.3
TXD
  Top 0.254: R10.2 18.55,21.8 16.3,21.8 15.82,21.32 IC2.15
VIO  (via drill 0.25)
  Top 0.203: v12.2,18.4 12.23,18.42
  Top 0.254: C5.1 10.15,20.02 IC2.8 11.48,19.42 11.5,19.4 11.62,19.27 IC2.9 12.23,18.42 | IC2.1 14.18,23.47 v14.3,23.6
  Bottom 0.254: v14.3,23.6 14.3,22.8 12.5,21 12.5,18.7 v12.2,18.4

### Text on the board
tPlace: SMAC Project | http://smacproject.org | +3V3 | GND | P1_0 | P1_1 | P1_2 | P1_3 | P1_4 | P1_5 | P1_6 | P1_7 | P2_0 | P1_4 | P1_1 | P1_0 | P0_1 | JUMPER J1 | LED4 | LED3 | LED2 | LED1 | BUT1 | CC-BY-SA 3.0 | NC | GND | CS | MOSI | D/!C | LCD3310 | SCLK | NC | RESET | NC | +3V3 | SMAC-2530 DEVELOPMENT BOARD v1.1 | P0_7 | P0_6 | P0_5 | P0_4 | P0_3 | P0_2 | P0_1 | P0_0 | GND | +3V3
Reference: DO NOT ROUTE ANTENNA TO 0V!